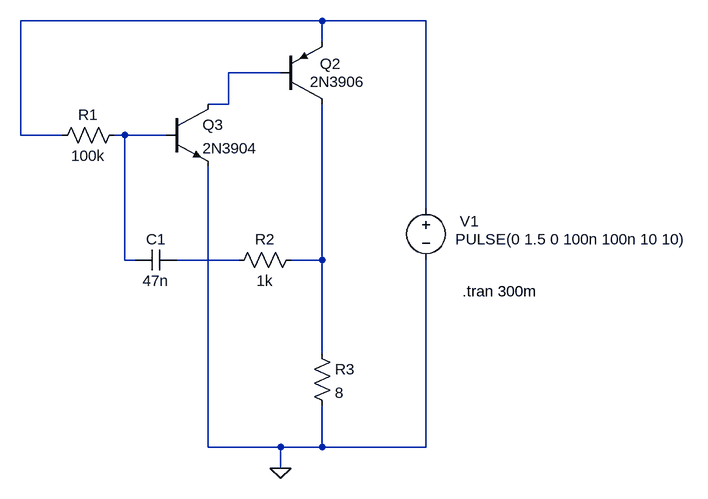
[diagram p0: schematic contact tester.asc]
contact tester.asc, the LTspice schematic file:
Version 4
SHEET 1 2692 680
WIRE 832 -704 368 -704
WIRE 992 -704 832 -704
WIRE 832 -672 832 -704
WIRE 768 -624 688 -624
WIRE 688 -576 688 -624
WIRE 688 -576 656 -576
WIRE 368 -528 368 -704
WIRE 432 -528 368 -528
WIRE 528 -528 512 -528
WIRE 592 -528 528 -528
WIRE 992 -416 992 -704
WIRE 528 -336 528 -528
WIRE 544 -336 528 -336
WIRE 704 -336 608 -336
WIRE 832 -336 832 -576
WIRE 832 -336 784 -336
WIRE 832 -192 832 -336
WIRE 656 -48 656 -480
WIRE 768 -48 656 -48
WIRE 832 -48 832 -112
WIRE 832 -48 768 -48
WIRE 992 -48 992 -336
WIRE 992 -48 832 -48
WIRE 768 -16 768 -48
FLAG 768 -16 0
SYMBOL voltage 992 -432 R0
WINDOW 3 45 64 Left 2
WINDOW 123 45 92 Left 2
WINDOW 39 45 92 Left 2
WINDOW 0 52 36 Left 2
SYMATTR Value PULSE(0 1.5 0 100n 100n 10 10)
SYMATTR InstName V1
SYMBOL npn 592 -576 R0
SYMATTR InstName Q3
SYMATTR Value 2N3904
SYMBOL cap 608 -320 M270
WINDOW 0 32 32 VTop 2
WINDOW 3 0 32 VBottom 2
SYMATTR InstName C1
SYMATTR Value 47n
SYMATTR SpiceLine Rser=1
SYMBOL pnp 768 -576 M180
WINDOW 0 61 62 Left 2
WINDOW 3 45 34 Left 2
SYMATTR InstName Q2
SYMATTR Value 2N3906
SYMBOL res 416 -512 R270
WINDOW 0 32 56 VTop 2
WINDOW 3 0 56 VBottom 2
SYMATTR InstName R1
SYMATTR Value 100k
SYMBOL res 800 -352 R90
WINDOW 0 0 56 VBottom 2
WINDOW 3 32 56 VTop 2
SYMATTR InstName R2
SYMATTR Value 1k
SYMBOL res 816 -208 R0
SYMATTR InstName R3
SYMATTR Value 8
TEXT 1048 -288 Left 2 !.tran 300m

The netlist it stands for:
* contact tester.asc
V1 N001 0 PULSE(0 1.5 0 100n 100n 10 10)
Q3 N002 N003 0 0 2N3904
C1 N004 N003 47n Rser=1
Q2 N005 N002 N001 0 2N3906
R1 N001 N003 100k
R2 N005 N004 1k
R3 N005 0 8
.model NPN NPN
.model PNP PNP
.lib standard.bjt
.tran 300m
.backanno
.end